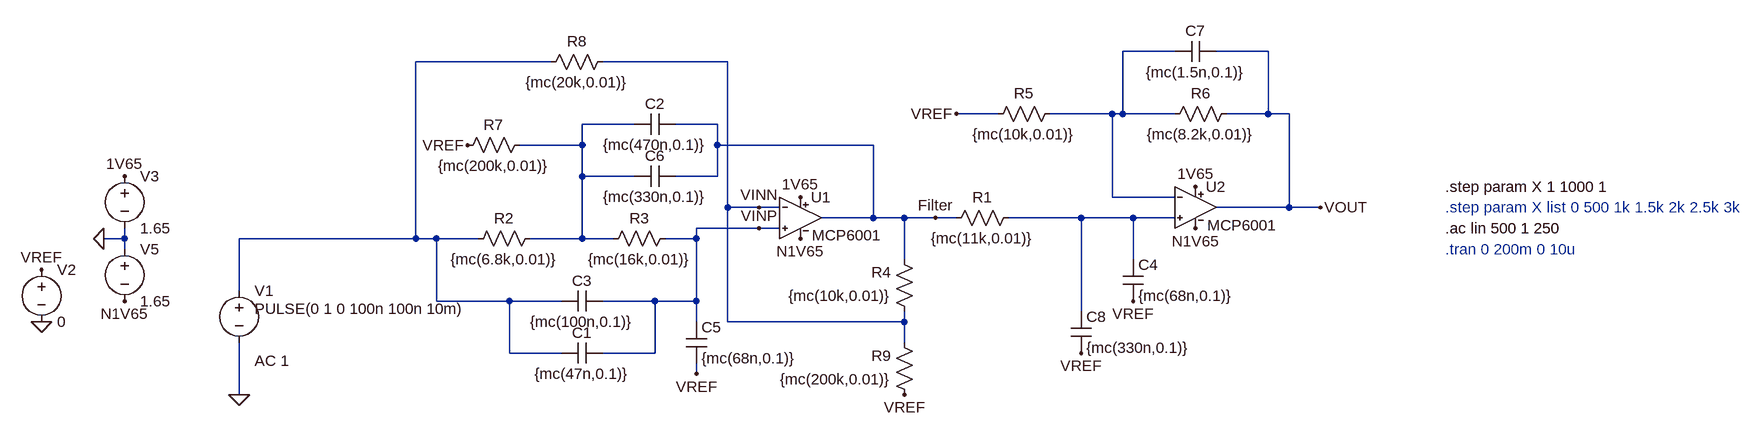
[diagram p0: schematic Hourglass_Monte_Carlo.asc]
Hourglass_Monte_Carlo.asc, the LTspice schematic file:
Version 4
SHEET 1 1584 1432
WIRE -240 624 -320 624
WIRE -96 624 -176 624
WIRE -1200 640 -1408 640
WIRE -928 640 -1120 640
WIRE -512 720 -576 720
WIRE -336 720 -432 720
WIRE -320 720 -320 624
WIRE -320 720 -336 720
WIRE -240 720 -320 720
WIRE -96 720 -96 624
WIRE -96 720 -160 720
WIRE -64 720 -96 720
WIRE -1072 736 -1152 736
WIRE -944 736 -1008 736
WIRE -1152 768 -1152 736
WIRE -1152 768 -1248 768
WIRE -944 768 -944 736
WIRE -704 768 -944 768
WIRE -1152 816 -1152 768
WIRE -1072 816 -1152 816
WIRE -944 816 -944 768
WIRE -944 816 -1008 816
WIRE -336 848 -336 720
WIRE -240 848 -336 848
WIRE -928 864 -928 640
WIRE -880 864 -928 864
WIRE -848 864 -880 864
WIRE -64 864 -64 720
WIRE -64 864 -176 864
WIRE -16 864 -64 864
WIRE -704 880 -704 768
WIRE -704 880 -784 880
WIRE -656 880 -704 880
WIRE -608 880 -656 880
WIRE -576 880 -608 880
WIRE -384 880 -496 880
WIRE -304 880 -384 880
WIRE -240 880 -304 880
WIRE -880 896 -976 896
WIRE -848 896 -880 896
WIRE -1856 912 -1856 896
WIRE -1856 912 -1888 912
WIRE -1408 912 -1408 640
WIRE -1408 912 -1680 912
WIRE -1376 912 -1408 912
WIRE -1312 912 -1376 912
WIRE -1152 912 -1152 816
WIRE -1152 912 -1232 912
WIRE -1104 912 -1152 912
WIRE -976 912 -976 896
WIRE -976 912 -1024 912
WIRE -1856 928 -1856 912
WIRE -656 944 -656 880
WIRE -304 944 -304 880
WIRE -1680 992 -1680 912
WIRE -1376 1008 -1376 912
WIRE -1264 1008 -1376 1008
WIRE -1184 1008 -1264 1008
WIRE -1040 1008 -1120 1008
WIRE -976 1008 -976 912
WIRE -976 1008 -1040 1008
WIRE -384 1024 -384 880
WIRE -976 1040 -976 1008
WIRE -928 1040 -928 864
WIRE -656 1040 -656 1024
WIRE -656 1040 -928 1040
WIRE -656 1072 -656 1040
WIRE -1264 1088 -1264 1008
WIRE -1184 1088 -1264 1088
WIRE -1040 1088 -1040 1008
WIRE -1040 1088 -1120 1088
WIRE -976 1120 -976 1104
WIRE -1680 1152 -1680 1072
FLAG -1984 1040 0
FLAG -1680 1152 0
FLAG -1984 960 VREF
FLAG -16 864 VOUT
FLAG -1856 816 1V65
FLAG -1888 912 0
FLAG -880 896 VINP
FLAG -1856 1008 N1V65
FLAG -880 864 VINN
FLAG -576 720 VREF
FLAG -1328 768 VREF
FLAG -976 1120 VREF
FLAG -304 1008 VREF
FLAG -656 1152 VREF
FLAG -608 880 Filter
FLAG -384 1088 VREF
FLAG -816 912 N1V65
FLAG -208 896 N1V65
FLAG -816 848 1V65
FLAG -208 832 1V65
SYMBOL MCP6001 -816 816 R0
SYMATTR InstName U1
SYMBOL voltage -1680 976 R0
WINDOW 3 24 44 Left 2
WINDOW 123 24 124 Left 2
WINDOW 39 0 0 Left 0
SYMATTR Value PULSE(0 1 0 100n 100n 10m)
SYMATTR Value2 AC 1
SYMATTR InstName V1
SYMBOL voltage -1984 944 R0
WINDOW 123 0 0 Left 0
WINDOW 39 24 124 Left 2
SYMATTR InstName V2
SYMATTR Value 0
SYMBOL voltage -1856 800 R0
WINDOW 123 0 0 Left 0
WINDOW 39 24 124 Left 2
SYMATTR InstName V3
SYMATTR Value 1.65
SYMBOL voltage -1856 912 R0
WINDOW 123 0 0 Left 0
WINDOW 39 24 124 Left 2
SYMATTR InstName V5
SYMATTR Value 1.65
SYMBOL res -480 864 R90
WINDOW 0 0 56 VBottom 2
WINDOW 3 32 56 VTop 2
SYMATTR InstName R1
SYMATTR Value {mc(11k,0.01)}
SYMBOL res -1216 896 R90
WINDOW 0 0 56 VBottom 2
WINDOW 3 32 56 VTop 2
SYMATTR InstName R2
SYMATTR Value {mc(6.8k,0.01)}
SYMBOL res -1008 896 R90
WINDOW 0 0 56 VBottom 2
WINDOW 3 32 56 VTop 2
SYMATTR InstName R3
SYMATTR Value {mc(16k,0.01)}
SYMBOL cap -1008 720 R90
WINDOW 0 0 32 VBottom 2
WINDOW 3 32 32 VTop 2
SYMATTR InstName C2
SYMATTR Value {mc(470n,0.1)}
SYMBOL cap -1120 992 R90
WINDOW 0 0 32 VBottom 2
WINDOW 3 32 32 VTop 2
SYMATTR InstName C3
SYMATTR Value {mc(100n,0.1)}
SYMBOL cap -320 944 R0
SYMATTR InstName C4
SYMATTR Value {mc(68n,0.1)}
SYMBOL cap -992 1040 R0
SYMATTR InstName C5
SYMATTR Value {mc(68n,0.1)}
SYMBOL res -640 1040 R180
WINDOW 0 36 76 Left 2
WINDOW 3 36 40 Left 2
SYMATTR InstName R4
SYMATTR Value {mc(10k,0.01)}
SYMBOL res -416 704 R90
WINDOW 0 0 56 VBottom 2
WINDOW 3 32 56 VTop 2
SYMATTR InstName R5
SYMATTR Value {mc(10k,0.01)}
SYMBOL res -1104 624 R90
WINDOW 0 0 56 VBottom 2
WINDOW 3 32 56 VTop 2
SYMATTR InstName R8
SYMATTR Value {mc(20k,0.01)}
SYMBOL MCP6001 -208 800 R0
SYMATTR InstName U2
SYMBOL res -144 704 R90
WINDOW 0 0 56 VBottom 2
WINDOW 3 32 56 VTop 2
SYMATTR InstName R6
SYMATTR Value {mc(8.2k,0.01)}
SYMBOL res -1232 752 R90
WINDOW 0 0 56 VBottom 2
WINDOW 3 32 56 VTop 2
SYMATTR InstName R7
SYMATTR Value {mc(200k,0.01)}
SYMBOL res -640 1168 R180
WINDOW 0 36 76 Left 2
WINDOW 3 36 40 Left 2
SYMATTR InstName R9
SYMATTR Value {mc(200k,0.01)}
SYMBOL cap -1120 1072 R90
WINDOW 0 0 32 VBottom 2
WINDOW 3 32 32 VTop 2
SYMATTR InstName C1
SYMATTR Value {mc(47n,0.1)}
SYMBOL cap -1008 800 R90
WINDOW 0 0 32 VBottom 2
WINDOW 3 32 32 VTop 2
SYMATTR InstName C6
SYMATTR Value {mc(330n,0.1)}
SYMBOL cap -176 608 R90
WINDOW 0 0 32 VBottom 2
WINDOW 3 32 32 VTop 2
SYMATTR InstName C7
SYMATTR Value {mc(1.5n,0.1)}
SYMBOL cap -400 1024 R0
SYMATTR InstName C8
SYMATTR Value {mc(330n,0.1)}
TEXT 176 928 Left 2 ;.tran 0 200m 0 10u
TEXT 176 896 Left 2 !.ac lin 500 1 250
TEXT 176 864 Left 2 ;.step param X list 0 500 1k 1.5k 2k 2.5k 3k
TEXT 176 832 Left 2 !.step param X 1 1000 1

The netlist it stands for:
* Hourglass_Monte_Carlo.asc
XU1 VINP VINN 1V65 N1V65 Filter MCP6001  ; pins In+ In- V+ V- OUT
V1 N002 0 PULSE(0 1 0 100n 100n 10m) AC 1
V2 VREF 0 0
V3 1V65 0 1.65
V5 0 N1V65 1.65
R1 N004 Filter {mc(11k,0.01)}
R2 N003 N002 {mc(6.8k,0.01)}
R3 VINP N003 {mc(16k,0.01)}
C2 Filter N003 {mc(470n,0.1)}
C3 VINP N002 {mc(100n,0.1)}
C4 N004 VREF {mc(68n,0.1)}
C5 VINP VREF {mc(68n,0.1)}
R4 VINN Filter {mc(10k,0.01)}
R5 N001 VREF {mc(10k,0.01)}
R8 VINN N002 {mc(20k,0.01)}
XU2 N004 N001 1V65 N1V65 VOUT MCP6001  ; pins In+ In- V+ V- OUT
R6 VOUT N001 {mc(8.2k,0.01)}
R7 N003 VREF {mc(200k,0.01)}
R9 VREF VINN {mc(200k,0.01)}
C1 VINP N002 {mc(47n,0.1)}
C6 Filter N003 {mc(330n,0.1)}
C7 VOUT N001 {mc(1.5n,0.1)}
C8 N004 VREF {mc(330n,0.1)}
* .tran 0 200m 0 10u
.ac lin 500 1 250
* .step param X list 0 500 1k 1.5k 2k 2.5k 3k
.step param X 1 1000 1
.lib MCP6001.lib
.backanno
.end